# Altium schematic sheet audio.SchDoc
size A4; SheetNumber: 4; SheetTotal: 4
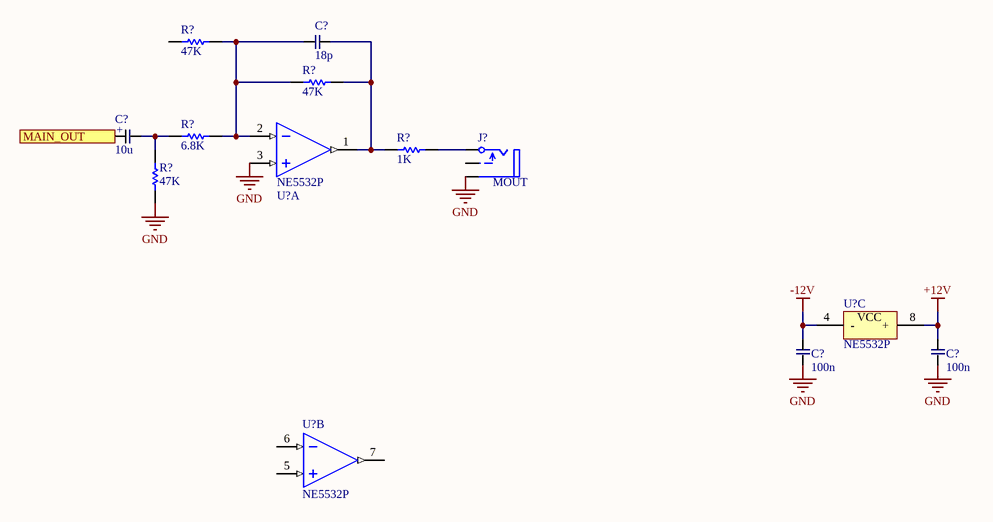
[diagram p0: audio.SchDoc]

## Parts
(Parts that share a designator on the sheet are numbered #1, #2 ... from top to bottom, then left to right.)
C?#1  value 18p  [C0603]  (hidden comment: Capacitor)
C?#2  value 10u  [ELCO_SMD_4x5.3mm]  (hidden comment: C_ELCO)
C?#3  value 100n  [C0603]  (hidden comment: Capacitor)
C?#4  value 100n  [C0603]  (hidden comment: Capacitor)
J?  MOUT  [PJ301_thonk]
R?#1  value 47K  [R0603]  (hidden comment: RESISTOR)
R?#2  value 47K  [R0603]  (hidden comment: RESISTOR)
R?#3  value 6.8K  [R0603]  (hidden comment: RESISTOR)
R?#4  value 1K  [R0603]  (hidden comment: RESISTOR)
R?#5  value 47K  [R0603]  (hidden comment: RESISTOR)
U?#1  NE5532P  [SOP8_M]  (part A of 3)
U?#2  NE5532P  [SOP8_M]  (part C of 3)
U?#3  NE5532P  [SOP8_M]  (part B of 3)

## Ports
MAIN_OUT (in)

## Nets
+12V: C?#4.1 U?#2.8(+)
-12V: C?#3.1 U?#2.4(-)
GND: C?#3.2 C?#4.2 J?.1(Ground) R?#5.1 U?#1.3(IN1+)
MAIN_OUT: C?#2.1(+) ; port MAIN_OUT
NetC?#1_1: C?#1.1 R?#2.2 R?#4.1 U?#1.1(OUT1)
NetC?#1_2: C?#1.2 R?#1.2 R?#2.1 R?#3.2 U?#1.2(IN1-)
NetC?#2_2: C?#2.2(-) R?#3.1 R?#5.2
NetJ?_3: J?.3(R_Aux_in) R?#4.2

Not connected (* = marked no-connect by the designer): J? 2(R_Radio_ch); R?#1 1; U?#3 5(IN2+) 6(IN2-) 7(OUT2)

## Notes on the sheet
- (in symbol NE5532P, part C) VCC

## Library data of the parts
C?#1 C?#3 C?#4 = Capacitor: Capacitor (Semiconductor SIM Model); Published: 8-Jun-2000; LatestRevisionDate: 29-May-2009; LatestRevisionNote: IPC-7351 Footprint Added.; PackageReference: C1206; Publisher: Altium Limited; PackageDescription: Chip Capacitor
J? = Audio_jack_mono: Value: Audio_jack_mono
U?#1-U?#3 = NE5532P: Dual Low-Noise High-Speed Audio Operational Amplifier, 10 to 30 V, 0 to 70 degC, 8-pin DIP (P8), Pb-Free (RoHS); Manufacturer: Texas Instruments; CMRR(Min)(dB): 70; GBW(Typ)(MHz): 10; IIB(Max)(pA): 800000; Iq per channel(Max)(mA): 4; Number of Channels: 2; Slew Rate(Typ)(V/us): 9; Sub Family: General Purpose Amplifier, High Supply Voltage Amplifier (>=30V), Low Noise Amp (<=10nV/rtHz); Total Supply Voltage(Max)(+5V is 5, +/-5V is 10): 30; Vn at 1kHz(Typ)(nV/rtHz): 5; DatasheetVersion: SLOS075I; PackageVersion: 4040082/E, 04/2010; PackageReference: P8; PackageDescription: 8-Pin Plastic In-Line, Body 9.59 x 6.35 mm, Pitch 2.54 mm; Supplier 1: Digi-Key; Supplier Part Number 1: 296-1410-5-ND; Supplier 2: Farnell; Supplier Part Number 2: 1106092; Supplier 3: Farnell; Supplier Part Number 3: 2119505; Supplier 4: Newark; Supplier Part Number 4: 59K8751; Supplier 5: Mouser; Supplier Part Number 5: 595-NE5532P; Eco-Plan: Pb-Free (RoHS); Total Supply Voltage(Min)(+5V is 5, +/-5V is 10): 10; Vio (25C)(Max)(mV): 4; Mounting Technology: Through Hole; Code_JEDEC: MS-001; PartNumber: NE5532P; ComponentLink1Description: Manufacturer URL; ComponentLink1URL: http://www.ti.com/; ComponentLink2Description: Datasheet; ComponentLink2URL: http://www.ti.com/lit/ds/symlink/ne5532.pdf; ComponentLink3Description: Package Specification; ComponentLink3URL: http://www.ti.com/litv/pdf/mpdi001b
R?#1-R?#5 = RESISTOR: Published: 8-Jun-2000; LatestRevisionDate: 17-Jul-2002; LatestRevisionNote: Re-released for DXP Platform.; PackageReference: AXIAL-0.3; Publisher: Altium Limited; PackageDescription: Axial Device, Thru-Hole; 2 Leads; 0.3 in Pin Spacing